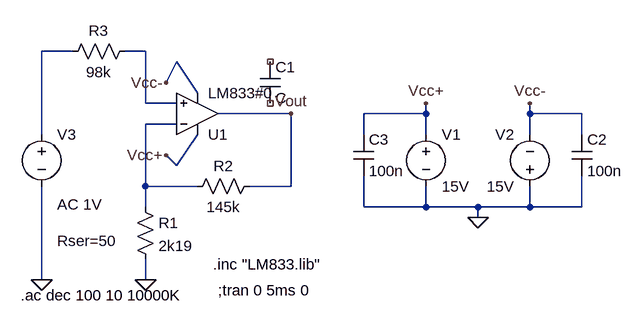
[diagram p0: schematic tc_tp2_ej2.asc]
tc_tp2_ej2.asc, the LTspice schematic file:
Version 4
SHEET 1 880 680
WIRE -272 16 -320 16
WIRE -160 16 -192 16
WIRE -128 64 -112 32
WIRE -80 80 -112 32
WIRE -160 96 -160 16
WIRE -112 96 -160 96
WIRE 64 112 -48 112
WIRE 272 112 272 96
WIRE 272 112 176 112
WIRE 432 112 432 96
WIRE 512 112 432 112
WIRE -112 128 -160 128
WIRE -320 144 -320 16
WIRE 176 144 176 112
WIRE 272 144 272 112
WIRE 432 144 432 112
WIRE 512 144 512 112
WIRE -112 192 -80 144
WIRE -112 192 -128 176
WIRE -160 224 -160 128
WIRE -80 224 -160 224
WIRE 64 224 64 112
WIRE 64 224 0 224
WIRE -160 256 -160 224
WIRE 176 256 176 208
WIRE 272 256 272 224
WIRE 272 256 176 256
WIRE 352 256 272 256
WIRE 432 256 432 224
WIRE 432 256 352 256
WIRE 512 256 512 208
WIRE 512 256 432 256
WIRE 352 272 352 256
WIRE -320 368 -320 224
WIRE -160 368 -160 336
FLAG 352 272 0
FLAG 272 96 Vcc+
FLAG 432 96 Vcc-
FLAG -320 368 0
FLAG -128 176 Vcc+
FLAG -128 64 Vcc-
FLAG -160 368 0
FLAG 64 112 Vout
SYMBOL voltage 272 128 R0
WINDOW 123 0 0 Left 2
WINDOW 39 0 0 Left 2
SYMATTR InstName V1
SYMATTR Value 15V
SYMBOL voltage 432 240 R180
WINDOW 0 24 96 Left 2
WINDOW 3 24 16 Left 2
WINDOW 123 0 0 Left 2
WINDOW 39 0 0 Left 2
SYMATTR InstName V2
SYMATTR Value 15V
SYMBOL res -176 240 R0
SYMATTR InstName R1
SYMATTR Value 2k19
SYMBOL res 16 208 R90
WINDOW 0 0 56 VBottom 2
WINDOW 3 32 56 VTop 2
SYMATTR InstName R2
SYMATTR Value 145k
SYMBOL res -176 0 R90
WINDOW 0 0 56 VBottom 2
WINDOW 3 32 56 VTop 2
SYMATTR InstName R3
SYMATTR Value 98k
SYMBOL voltage -320 128 R0
WINDOW 3 24 152 Left 2
WINDOW 123 24 124 Left 2
WINDOW 39 24 180 Left 2
SYMATTR Value ""
SYMATTR Value2 AC 1V
SYMATTR SpiceLine Rser=50
SYMATTR InstName V3
SYMBOL Opamps\\opamp2 -80 176 M180
SYMATTR InstName U1
SYMATTR Value LM833#0
SYMBOL cap 496 144 R0
SYMATTR InstName C2
SYMATTR Value 100n
SYMBOL cap 160 144 R0
SYMATTR InstName C3
SYMATTR Value 100n
SYMBOL cap 16 32 R0
SYMATTR InstName C1
TEXT -56 344 Left 2 !.inc "LM833.lib"
TEXT -352 392 Left 2 !.ac dec 100 10 10000K
TEXT -48 384 Left 2 !;tran 0 5ms 0

The netlist it stands for:
* tc_tp2_ej2.asc
V1 Vcc+ 0 15V
V2 0 Vcc- 15V
R1 N003 0 2k19
R2 Vout N003 145k
R3 N002 N001 98k
V3 N001 0 AC 1V Rser=50
XU1 N002 N003 Vcc+ Vcc- Vout LM833#0  ; pins In+ In- V+ V- OUT
C2 Vcc- 0 100n
C3 Vcc+ 0 100n
C1 NC_01 NC_02 C
.inc "LM833.lib"
.ac dec 100 10 10000K
;tran 0 5ms 0
.backanno
.end